# Altium schematic sheet TopPannel.SchDoc
size A3; SheetNumber: 1; SheetTotal: 3
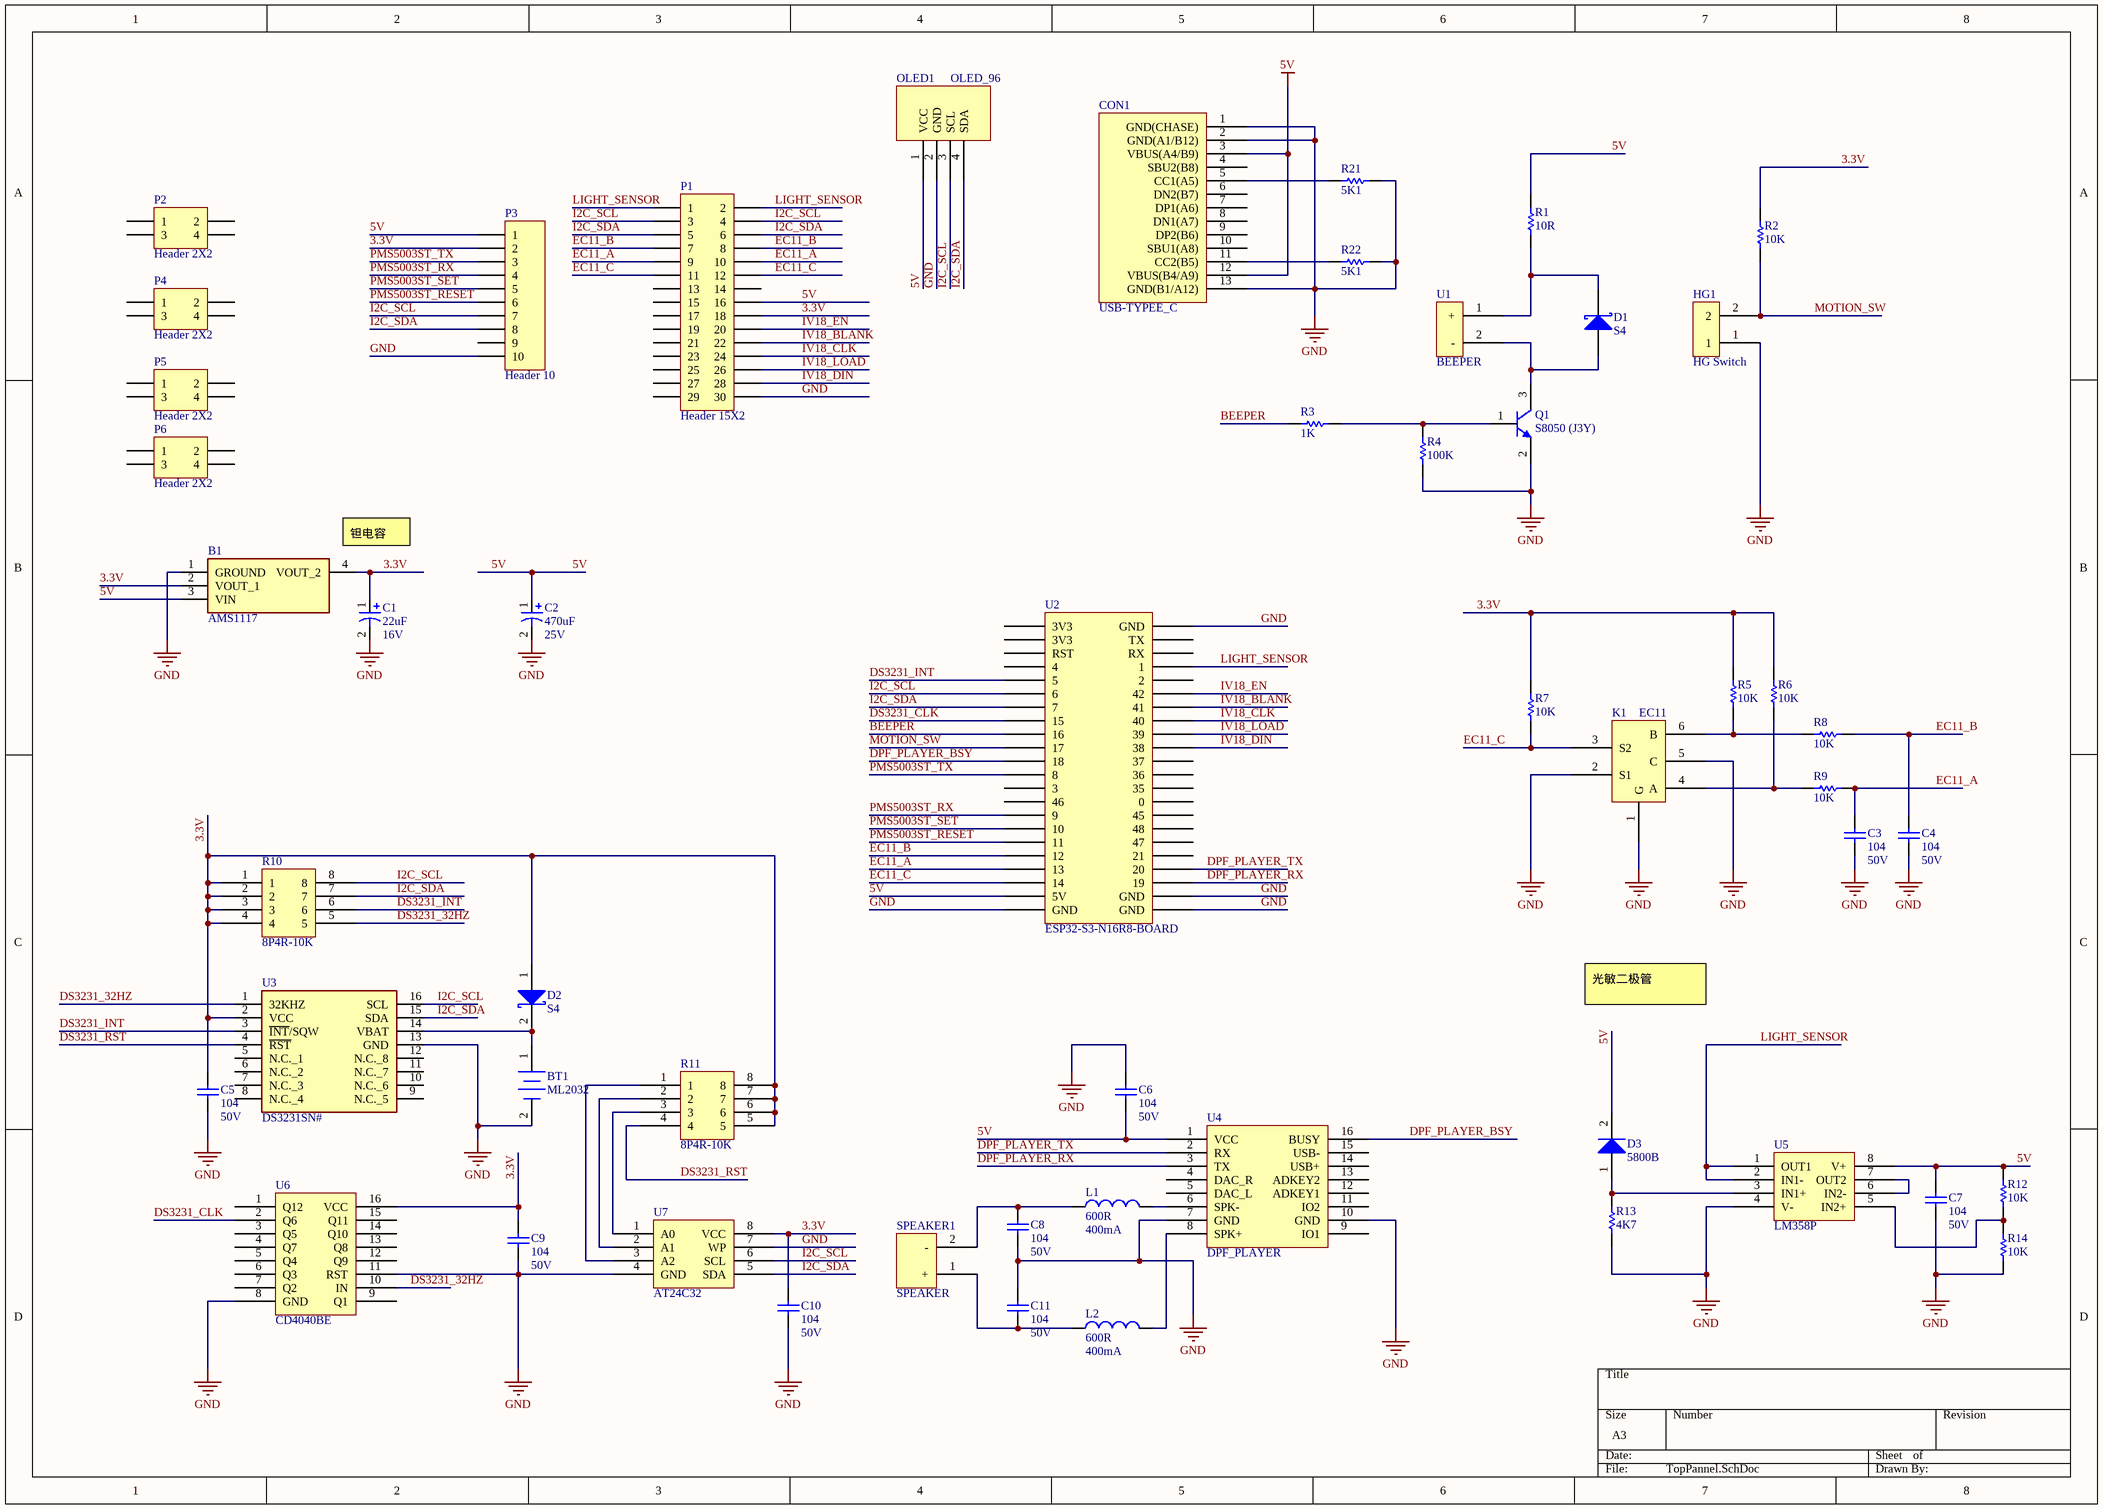
[diagram p0: TopPannel.SchDoc]

## Parts
B1  AMS1117  [SOT229P700X180-4N]
BT1  ML2032  [BAT2025-2032-L]
C1  16V  value 22uF  [TC3216-1206]
C2  25V  value 470uF  [SMD-EC-F10]
C3  50V  value 104  [CAPC1608L]
C4  50V  value 104  [CAPC1608L]
C5  50V  value 104  [CAPC1608L]
C6  50V  value 104  [CAPC1608L]
C7  50V  value 104  [CAPC1608L]
C8  50V  value 104  [CAPC1608L]
C9  50V  value 104  [CAPC1608L]
C10  50V  value 104  [CAPC1608L]
C11  50V  value 104  [CAPC1608L]
CON1  USB-TYPEE_C  [USB-TYPE_C]
D1  S4  [CD3216-1206]
D2  S4  [CD3216-1206]
D3  5800B  [5800B]
HG1  HG Switch  [HG]
K1  EC11  [EC11]
L1  400mA  value 600R  [CAPC2012L]
L2  400mA  value 600R  [CAPC2012L]
OLED1  OLED_96  [OLED_96]
P1  Header 15X2  [HDR2X15]
P2  Header 2X2  [HDR2X2]
P3  Header 10  [XH254-W-10P]
P4  Header 2X2  [HDR2X2]
P5  Header 2X2  [HDR2X2]
P6  Header 2X2  [HDR2X2]
Q1  S8050 (J3Y)  [SOT-23B_L]
R1  value 10R  [RESC1608L]  (hidden comment: Res1)
R2  value 10K  [RESC1608L]  (hidden comment: Res1)
R3  value 1K  [RESC1608L]  (hidden comment: Res1)
R4  value 100K  [RESC1608L]  (hidden comment: Res1)
R5  value 10K  [RESC1608L]  (hidden comment: Res1)
R6  value 10K  [RESC1608L]  (hidden comment: Res1)
R7  value 10K  [RESC1608L]  (hidden comment: Res1)
R8  value 10K  [RESC1608L]  (hidden comment: Res1)
R9  value 10K  [RESC1608L]  (hidden comment: Res1)
R10  8P4R-10K  [8P4R 0603]
R11  8P4R-10K  [8P4R 0603]
R12  value 10K  [RESC1608L]  (hidden comment: Res1)
R13  value 4K7  [RESC1608L]  (hidden comment: Res1)
R14  value 10K  [RESC1608L]  (hidden comment: Res1)
R21  value 5K1  [RESC1608L]  (hidden comment: Res1)
R22  value 5K1  [RESC1608L]  (hidden comment: Res1)
SPEAKER1  SPEAKER  [SPEAKER]
U1  BEEPER  [BEEPER]
U2  ESP32-S3-N16R8-BOARD  [ESP32-S3-N16R8-BOARD]
U3  DS3231SN#  [SOIC127P1032X265-16N]
U4  DPF_PLAYER  [DPF_PLAYER]
U5  LM358P  [DIP-8]
U6  CD4040BE  [DIP-16]
U7  AT24C32  [DIP-8]

## Nets
5V: B1.3(VIN) C2.1 C6.1 C7.2 CON1.3(VBUS(A4/B9)) CON1.12(VBUS(B4/A9)) D3.2(K) OLED1.1(VCC) P1.16 P3.1 R1.1 R12.1 U2.21(5V) U4.1(VCC) U5.8(V+)
GND: B1.1(GROUND) BT1.2(-) C1.2 C2.2 C3.1 C4.1 C5.1 C6.2 C7.1 C8.1 C9.1 C10.1 C11.2 CON1.1(GND(CHASE)) CON1.2(GND(A1/B12)) CON1.13(GND(B1/A12)) HG1.1 K1.1(G) K1.2(S1) K1.5(C) OLED1.2(GND) P1.30 P3.10 Q1.2(E) R4.2 R13.2 R14.2 R21.2 R22.2 U2.22(GND) U2.23(GND) U2.24(GND) U2.44(GND) U3.13(GND) U4.7(GND) U4.10(GND) U5.4(V-) U6.8(GND) U6.11(RST) U7.4(GND) U7.7(WP)
3.3V: B1.2(VOUT_1) B1.4(VOUT_2) C1.1 C5.2 C9.2 C10.2 D2.1(A) P1.18 P3.2 R2.1 R5.1 R6.1 R7.1 R10.1 R10.2 R10.3 R10.4 R11.5 R11.6 R11.7 R11.8 U3.2(VCC) U6.16(VCC) U7.8(VCC)
BEEPER: R3.1 U2.9(16)
DPF_PLAYER_BSY: U2.11(18) U4.16(BUSY)
DPF_PLAYER_RX: U2.25(19) U4.3(TX)
DPF_PLAYER_TX: U2.26(20) U4.2(RX)
DS3231_32HZ: R10.5 U3.1(32KHZ) U6.10(IN)
DS3231_CLK: U2.8(15) U6.2(Q6)
DS3231_INT: R10.6 U2.5 U3.3(~{INT}/SQW)
DS3231_RST: R11.4 U3.4(~{RST})
EC11_A: C3.2 P1.9 P1.10 R9.2 U2.19(13)
EC11_B: C4.2 P1.7 P1.8 R8.2 U2.18(12)
EC11_C: K1.3(S2) P1.11 P1.12 R7.2 U2.20(14)
I2C_SCL: OLED1.3(SCL) P1.3 P1.4 P3.7 R10.8 U2.6 U3.16(SCL) U7.6(SCL)
I2C_SDA: OLED1.4(SDA) P1.5 P1.6 P3.8 R10.7 U2.7 U3.15(SDA) U7.5(SDA)
IV18_BLANK: P1.22 U2.38(41)
IV18_CLK: P1.24 U2.37(40)
IV18_DIN: P1.28 U2.35(38)
IV18_EN: P1.20 U2.39(42)
IV18_LOAD: P1.26 U2.36(39)
LIGHT_SENSOR: P1.1 P1.2 U2.41(1) U5.1(OUT1) U5.2(IN1-)
MOTION_SW: HG1.2 R2.2 U2.10(17)
PMS5003ST_RESET: P3.6 U2.17(11)
PMS5003ST_RX: P3.4 U2.15(9)
PMS5003ST_SET: P3.5 U2.16(10)
PMS5003ST_TX: P3.3 U2.12(8)
NetBT1_1: BT1.1(+) D2.2(K) U3.14(VBAT)
NetC8_2: C8.2 L1.1 SPEAKER1.2(-)
NetC11_1: C11.1 L2.1 SPEAKER1.1(+)
NetCON1_5: CON1.5(CC1(A5)) R21.1
NetCON1_11: CON1.11(CC2(B5)) R22.1
NetD1_1: D1.1(A) Q1.3(C) U1.2(-)
NetD1_2: D1.2(K) R1.2 U1.1(+)
NetD3_1: D3.1(A) R13.1 U5.3(IN1+)
NetK1_4: K1.4(A) R6.2 R9.1
NetK1_6: K1.6(B) R5.2 R8.1
NetL1_2: L1.2 U4.6(SPK-)
NetL2_2: L2.2 U4.8(SPK+)
NetQ1_1: Q1.1(B) R3.2 R4.1
NetR11_1: R11.1 U7.3(A2)
NetR11_2: R11.2 U7.2(A1)
NetR11_3: R11.3 U7.1(A0)
NetR12_2: R12.2 R14.1 U5.5(IN2+)
NetU5_6: U5.6(IN2-) U5.7(OUT2)

Not connected (* = marked no-connect by the designer): CON1 4(SBU2(B8)) 6(DN2(B7)) 7(DP1(A6)) 8(DN1(A7)) 9(DP2(B6)) 10(SBU1(A8)); P1 13 14 15 17 19 21 23 25 27 29; P2 1 2 3 4; P3 9; P4 1 2 3 4; P5 1 2 3 4; P6 1 2 3 4; U2 1(3V3) 2(3V3) 3(RST) 4 13(3) 14(46) 27(21) 28(47) 29(48) 30(45) 31(0) 32(35) 33(36) 34(37) 40(2) 42(RX) 43(TX); U3 5(N.C._1) 6(N.C._2) 7(N.C._3) 8(N.C._4) 9(N.C._5) 10(N.C._6) 11(N.C._7) 12(N.C._8); U4 4(DAC_R) 5(DAC_L) 9(IO1) 11(IO2) 12(ADKEY1) 13(ADKEY2) 14(USB+) 15(USB-); U6 1(Q12) 3(Q5) 4(Q7) 5(Q4) 6(Q3) 7(Q2) 9(Q1) 12(Q9) 13(Q8) 14(Q10) 15(Q11)

## Notes on the sheet
- (near B1) 钽电容
- 光敏二极管

## Library data of the parts
B1 = AMS1117: 1117; Manufacturer_Name: Advanced Monolithic Systems; Geometry.Height: 1.8mm; Manufacturer_Part_Number: AMS1117; Mouser Part Number: *; Mouser Price/Stock: *; Arrow Part Number: *; Arrow Price/Stock: *; Datasheet Link: https://datasheet.lcsc.com/szlcsc/Advanced-Monolithic-Systems-AMS-AMS1117-ADJ_C6188.pdf
BT1 = Battery: Multicell Battery; Published: 24-Mar-1999; LatestRevisionDate: 17-Jul-2002; LatestRevisionNote: Re-released for DXP Platform.; PackageReference: BAT-2; Publisher: Altium Limited; PackageDescription: Battery; 2 Leads
C1 C2 = Cap Pol1: Polarized Capacitor (Radial); Published: 8-Jun-2000; LatestRevisionDate: 17-Jul-2002; LatestRevisionNote: Re-released for DXP Platform.; PackageReference: RB7.6-15; Publisher: Altium Limited; PackageDescription: Polarized Capacitor (Radial); 2 Leads
C3-C11 = Cap: Capacitor; Published: 8-Jun-2000; LatestRevisionDate: 17-Jul-2002; LatestRevisionNote: Re-released for DXP Platform.; PackageReference: RAD-0.3; Publisher: Altium Limited; PackageDescription: Radial Cap, Thru-Hole; 2 Leads; 0.3 in Pin Spacing
D1 D2 = D Schottky: Schottky Diode; Published: 8-Jun-2000; LatestRevisionDate: 17-Jul-2002; LatestRevisionNote: Re-released for DXP Platform.; PackageReference: SMB; Publisher: Altium Limited; PackageDescription: DO-214-AA/SMB; 2 C-Bend Leads; Body 5.3 x 3.6 mm, inc. leads (LxW); Code_JEDEC: DO-214-AA
D3 = Diode: Default Diode; Published: 8-Jun-2000; LatestRevisionDate: 17-Jul-2002; LatestRevisionNote: Re-released for DXP Platform.; PackageVersion: Sep-1996; PackageReference: SMC; Publisher: Altium Limited; PackageDescription: DO-214-AB/SMC; 2 C-Bend Leads; Body 7.9 x 5.9 mm, inc. leads (LxW); Code_JEDEC: DO-214-AB
HG1 = HG
L1 L2 = Inductor: Code_IEC: 1005; Published: 8-Jun-2000; LatestRevisionDate: 29-May-2009; LatestRevisionNote: IPC-7351 Footprint Added.; PackageReference: 0402-A; Publisher: Altium Limited; PackageDescription: Chip Inductor; Code_JEITA: 0402
P1 = Header 15X2: Header, 15-Pin, Dual row; LatestRevisionDate: 17-Jul-2002; LatestRevisionNote: Re-released for DXP Platform.; Publisher: Altium Limited
P2 P4-P6 = Header 2X2: Header, 2-Pin, Dual row; LatestRevisionDate: 17-Jul-2002; LatestRevisionNote: Re-released for DXP Platform.; Publisher: Altium Limited
P3 = Header 10: Header, 10-Pin; LatestRevisionDate: 17-Jul-2002; LatestRevisionNote: Re-released for DXP Platform.; Publisher: Altium Limited
Q1 = NPN: NPN Bipolar Transistor; Published: 8-Jun-2000; LatestRevisionDate: 17-Jul-2002; LatestRevisionNote: Re-released for DXP Platform.; PackageReference: TO-226-AA; Publisher: Altium Limited; PackageDescription: TO, Flat Index; 3 In-Line, Axial Leads; Body Dia. 4.8mm; Leads 0.55 x 0.51 mm (max); Code_JEDEC: TO-226-AA
R1-R9 R12-R14 R21 R22 = Res1: Resistor; Published: 8-Jun-2000; LatestRevisionDate: 17-Jul-2002; LatestRevisionNote: Re-released for DXP Platform.; PackageReference: AXIAL-0.3; Publisher: Altium Limited; PackageDescription: Axial Device, Thru-Hole; 2 Leads; 0.3 in Pin Spacing
R10 R11 = 8P4R
U3 = DS3231SN#: Real Time Clock Serial Maxim DS3231SN# Real Time Clock, Battery Backup, Calendar, Clock, I2C, 5.5 V, 16-Pin SOIC; Manufacturer_Name: Analog Devices; Geometry.Height: 2.65mm; Manufacturer_Part_Number: DS3231SN#; Mouser Part Number: 700-DS3231SN#; Mouser Price/Stock: https://www.mouser.co.uk/ProductDetail/Analog-Devices-Maxim-Integrated/DS3231SN?qs=1eQvB6Dk1vhUlr8%2FOrV0Fw%3D%3D; Arrow Part Number: DS3231SN#; Arrow Price/Stock: https://www.arrow.com/en/products/ds3231sn_2/analog-devices.html?utm_currency=USD&region=nac; Datasheet Link: https://datasheets.maximintegrated.com/en/ds/DS3231.pdf